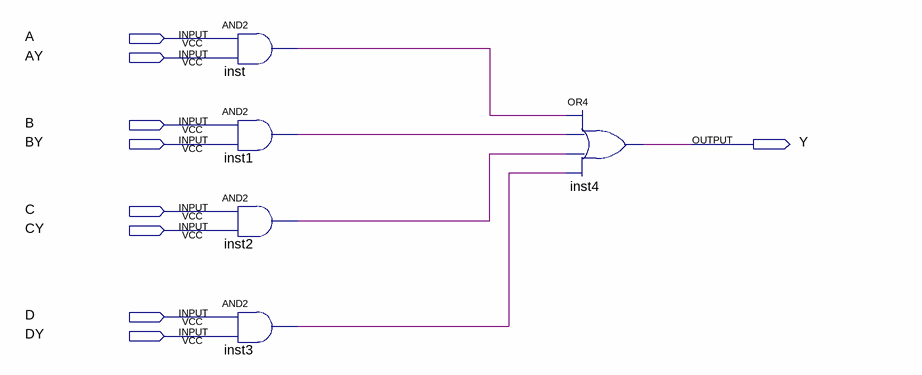
[diagram p0: schematic sheet]
// Quartus schematic x1_4_1.bdf as structural Verilog: 5 symbols, 9 pins
module x1_4_1 (
  input  A,
  input  AY,
  input  B,
  input  BY,
  input  C,
  input  CY,
  input  D,
  input  DY,
  output Y
);

  wire inst1_out, inst2_out, inst3_out, inst_out;

  and inst (inst_out, A, AY);
  and inst1 (inst1_out, B, BY);
  and inst2 (inst2_out, C, CY);
  and inst3 (inst3_out, D, DY);
  or inst4 (Y, inst_out, inst1_out, inst2_out, inst3_out);
endmodule
